# Altium schematic sheet Display.SchDoc
size 381 x 241 mm; SheetNumber: 1; SheetTotal: 1
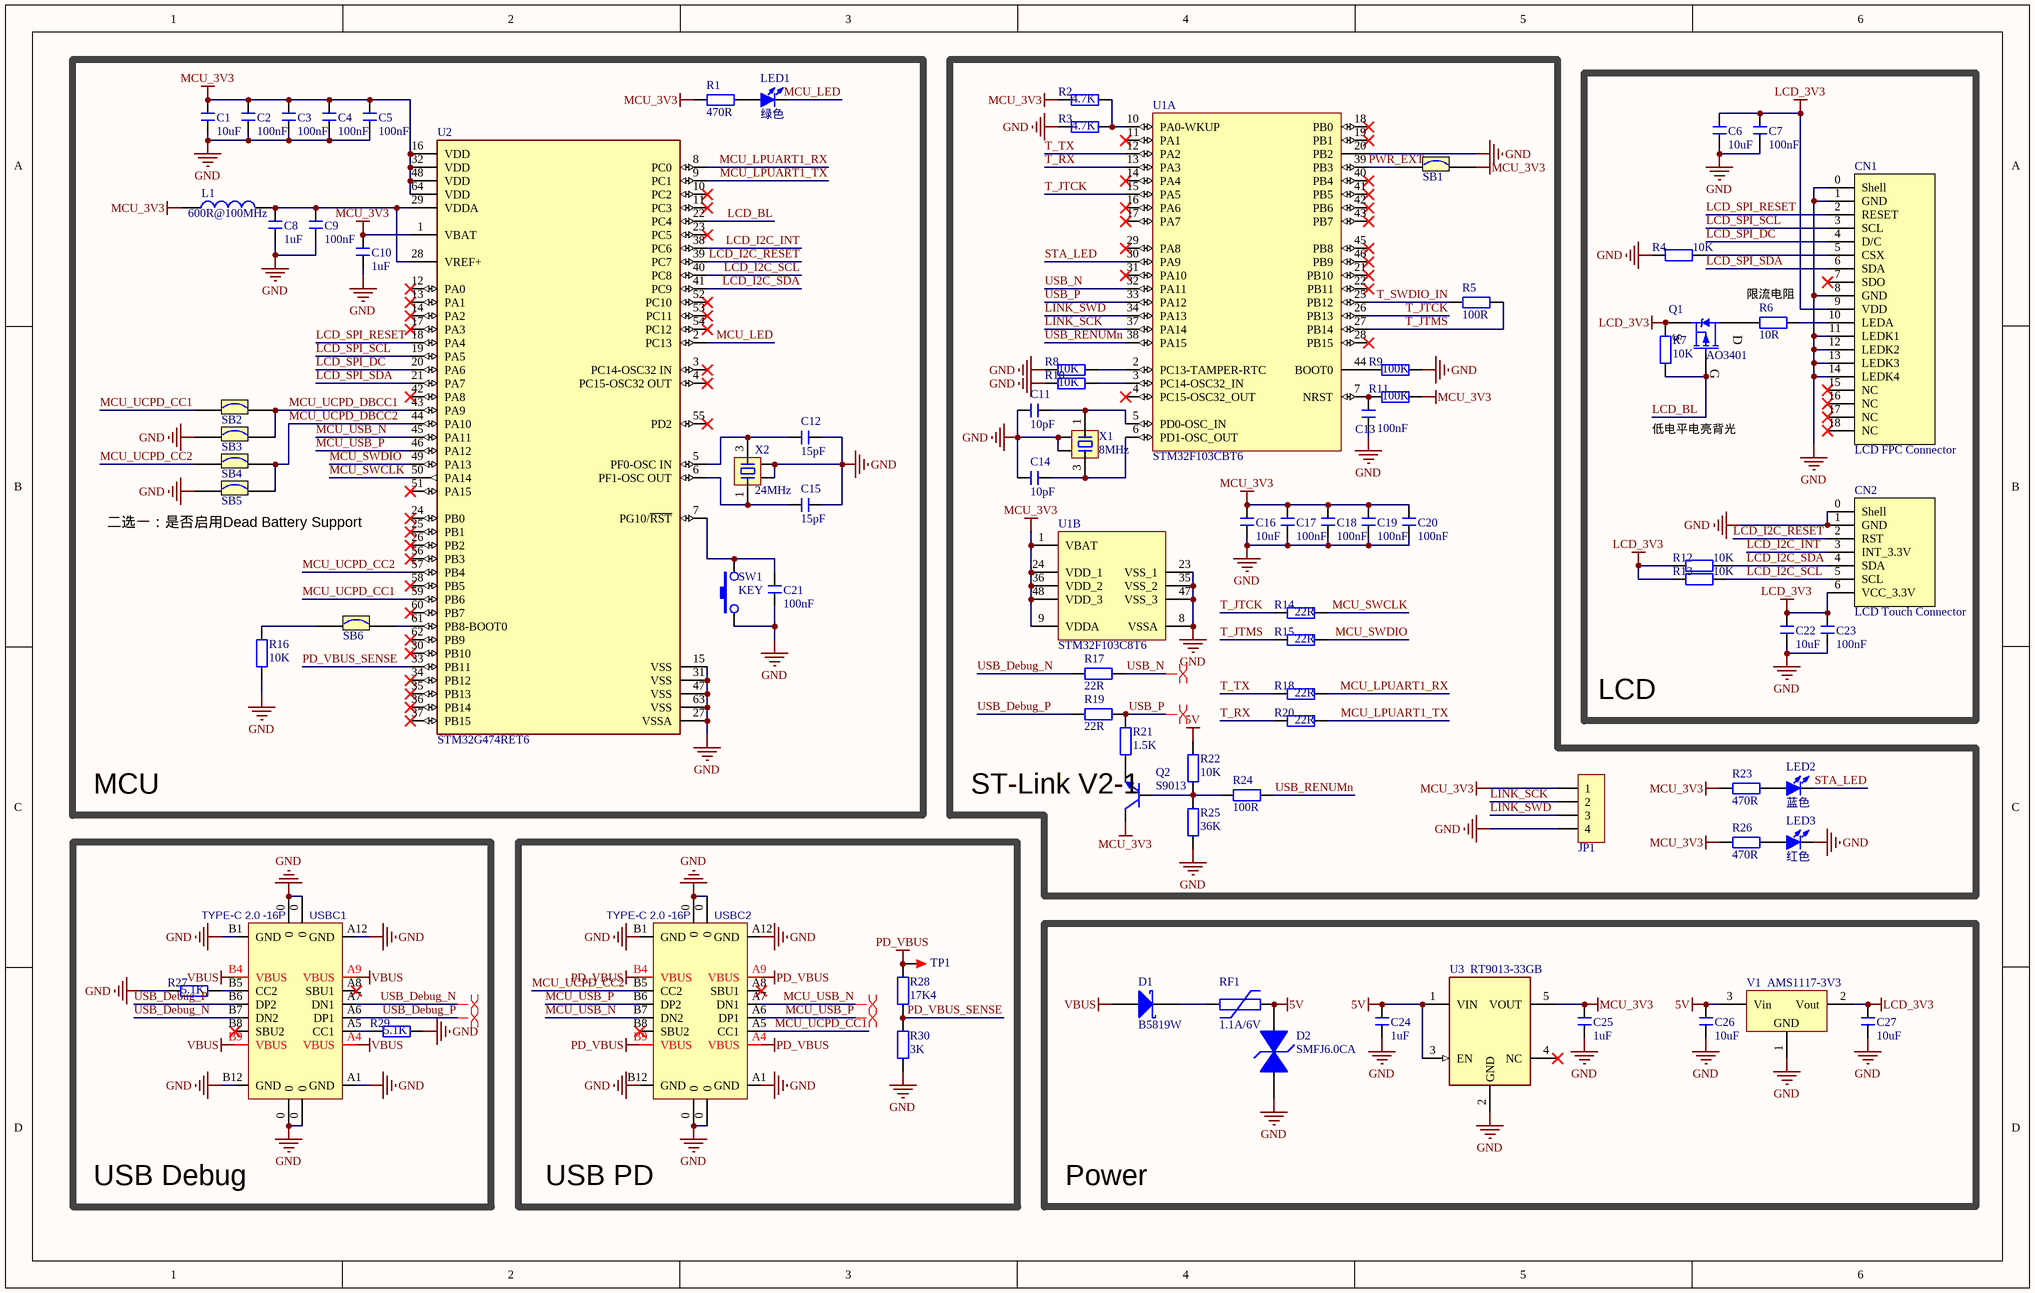
[diagram p0: Display.SchDoc]

## Parts
C1  10uF  [C 0402_L]
C2  100nF  [C 0402_L]
C3  100nF  [C 0402_L]
C4  100nF  [C 0402_L]
C5  100nF  [C 0402_L]
C6  10uF  [C 0402_L]
C7  100nF  [C 0402_L]
C8  1uF  [C 0402_L]
C9  100nF  [C 0402_L]
C10  1uF  [C 0402_L]
C11  10pF  [C 0402_L]
C12  15pF  [C 0402_L]
C13  100nF  [C 0402_L]
C14  10pF  [C 0402_L]
C15  15pF  [C 0402_L]
C16  10uF  [C 0402_L]
C17  100nF  [C 0402_L]
C18  100nF  [C 0402_L]
C19  100nF  [C 0402_L]
C20  100nF  [C 0402_L]
C21  100nF  [C 0402_L]
C22  10uF  [C 0402_L]
C23  100nF  [C 0402_L]
C24  1uF  [C 0402_L]
C25  1uF  [C 0402_L]
C26  10uF  [C 0402_L]
C27  10uF  [C 0402_L]
CN1  LCD FPC Connector  [FPC_Connector_0.5mm_18P]
CN2  LCD Touch Connector  [FPC_Connector_0.5mm_6P]
D1  B5819W  [MCC-SOD123_V]
D2  SMFJ6.0CA  [SMFJ6.0CA]
JP1  HDR-1X4  [HDR2.54-LI-4P]  (value not drawn)
L1  600R@100MHz  [L 0603]
LED1  绿色  [LED 0603G]
LED2  蓝色  [LED 0603B]
LED3  红色  [LED 0603R]
Q1  AO3401  [SOT23-3L]
Q2  S9013  [SOT23-3L]
R1  470R  [R 0402_L]
R2  4.7K  [R 0402_L]
R3  4.7K  [R 0402_L]
R4  10K  [R 0402_L]
R5  100R  [R 0402_L]
R6  10R  [R 0402_L]
R7  10K  [R 0402_L]
R8  10K  [R 0402_L]
R9  100K  [R 0402_L]
R10  10K  [R 0402_L]
R11  100K  [R 0402_L]
R12  10K  [R 0402_L]
R13  10K  [R 0402_L]
R14  22R  [R 0402_L]
R15  22R  [R 0402_L]
R16  10K  [R 0402_L]
R17  22R  [R 0402_L]
R18  22R  [R 0402_L]
R19  22R  [R 0402_L]
R20  22R  [R 0402_L]
R21  1.5K  [R 0402_L]
R22  10K  [R 0402_L]
R23  470R  [R 0402_L]
R24  100R  [R 0402_L]
R25  36K  [R 0402_L]
R26  470R  [R 0402_L]
R27  5.1K  [R 0402_L]
R28  17K4  [R 0402_L]
R29  5.1K  [R 0402_L]
R30  3K  [R 0402_L]
RF1  1.1A/6V  [MF-NSMF110-2]
SB1  SelectBit  [SelectBit 0402]  (value not drawn)
SB2  SelectBit  [SelectBit 0402]  (value not drawn)
SB3  SelectBit  [SelectBit 0402]  (value not drawn)
SB4  SelectBit  [SelectBit 0402]  (value not drawn)
SB5  SelectBit  [SelectBit 0402]  (value not drawn)
SB6  SelectBit  [SelectBit 0402]  (value not drawn)
SW1  KEY  [小乌龟2脚轻触开关3.9*2.9]
TP1  TEST TP  [TEST TP1.4_R]  (value not drawn)
U1  STM32F103CBT6  [STM-LQFP48_L]  (parts A,B of 2)
U2  STM32G474RET6  [FP-LQFP64-5W-MFG]
U3  RT9013-33GB  [SOT94P279X129-5N]
USBC1  TYPE-C 2.0 -16P  [USB-C-SMD_16P]
USBC2  TYPE-C 2.0 -16P  [USB-C-SMD_16P]
V1  AMS1117-3V3  [SOT89_L]
X1  8MHz  [XTAL-3225-4P]
X2  24MHz  [XTAL-3225-4P]

## Blocks framed on the sheet
MCU: C1-C5 C8-C10 C12 C15 C21 L1 LED1 R1 R16 SB2-SB6 SW1 U2 X2
ST-Link V2-1: C11 C13 C14 C16-C20 JP1 LED2 LED3 Q2 R2 R3 R5 R8-R11 R14 R15 R17-R26 SB1 U1 X1
LCD: C6 C7 C22 C23 CN1 CN2 Q1 R4 R6 R7 R12 R13
USB Debug: R27 R29 USBC1
USB PD: R28 R30 TP1 USBC2
Power: C24-C27 D1 D2 RF1 U3 V1

## Nets
5V: C24.2 C26.2 D2.2 R22.2 RF1.2 U3.1(VIN) U3.3(EN) V1.3(Vin)
GND: C1.1 C2.1 C3.1 C4.1 C5.1 C6.1 C7.1 C8.1 C9.1 C10.1 C11.2 C12.1 C13.1 C14.2 C15.1 C16.1 C17.1 C18.1 C19.1 C20.1 C21.2 C22.1 C23.1 C24.1 C25.1 C26.1 C27.1 CN1.0(Shell) CN1.1(GND) CN1.8(GND) CN1.11(LEDK1) CN1.12(LEDK2) CN1.13(LEDK3) CN1.14(LEDK4) CN2.0(Shell) CN2.1(GND) D2.1 JP1.4 LED3.2(K) R3.1 R4.1 R8.2 R9.1 R10.2 R16.2 R25.1 R27.2 R29.1 R30.2 SB3.1 SB5.1 SW1.1 U1.8(VSSA) U1.20(PB2) U1.23(VSS_1) U1.35(VSS_2) U1.47(VSS_3) U2.15(VSS) U2.27(VSSA) U2.31(VSS) U2.47(VSS) U2.63(VSS) U3.2(GND) USBC1.0 USBC1.A1(GND) USBC1.A12(GND) USBC1.B1(GND) USBC1.B12(GND) USBC2.0 USBC2.A1(GND) USBC2.A12(GND) USBC2.B1(GND) USBC2.B12(GND) V1.1(GND) X1.2 X1.4 X2.2 X2.4
LCD_3V3: C6.2 C7.2 C22.2 C23.2 C27.2 CN1.9(VDD) CN2.6(VCC_3.3V) Q1.2(S) R7.2 R12.2 R13.2 V1.2(Vout)
MCU_3V3: C1.2 C2.2 C3.2 C4.2 C5.2 C10.2 C16.2 C17.2 C18.2 C19.2 C20.2 C25.2 JP1.1 L1.1 Q2.3(C) R1.2 R2.1 R11.1 R23.2 R26.2 SB1.2 U1.1(VBAT) U1.9(VDDA) U1.24(VDD_1) U1.36(VDD_2) U1.48(VDD_3) U2.1(VBAT) U2.16(VDD) U2.32(VDD) U2.48(VDD) U2.64(VDD) U3.5(VOUT)
PD_VBUS: R28.1 TP1.1 USBC2.A4(VBUS) USBC2.A9(VBUS) USBC2.B4(VBUS) USBC2.B9(VBUS)
VBUS: D1.1(A) USBC1.A4(VBUS) USBC1.A9(VBUS) USBC1.B4(VBUS) USBC1.B9(VBUS)
LCD_BL: Q1.1(G) R7.1 U2.22(PC4)
LCD_I2C_INT: CN2.3(INT_3.3V) U2.38(PC6)
LCD_I2C_RESET: CN2.2(RST) U2.39(PC7)
LCD_I2C_SCL: CN2.5(SCL) R13.1 U2.40(PC8)
LCD_I2C_SDA: CN2.4(SDA) R12.1 U2.41(PC9)
LCD_SPI_DC: CN1.4(D/C) U2.20(PA6)
LCD_SPI_RESET: CN1.2(RESET) U2.18(PA4)
LCD_SPI_SCL: CN1.3(SCL) U2.19(PA5)
LCD_SPI_SDA: CN1.6(SDA) U2.21(PA7)
LINK_SCK: JP1.2 U1.37(PA14)
LINK_SWD: JP1.3 U1.34(PA13)
MCU_LED: LED1.2(K) U2.2(PC13)
MCU_LPUART1_RX: R18.1 U2.8(PC0)
MCU_LPUART1_TX: R20.1 U2.9(PC1)
MCU_SWCLK: R14.1 U2.50(PA14)
MCU_SWDIO: R15.1 U2.49(PA13)
MCU_UCPD_CC1: SB2.1 U2.59(PB6) USBC2.A5(CC1)
MCU_UCPD_CC2: SB4.1 U2.57(PB4) USBC2.B5(CC2)
MCU_UCPD_DBCC1: SB2.2 SB3.2 U2.43(PA9)
MCU_UCPD_DBCC2: SB4.2 SB5.2 U2.44(PA10)
MCU_USB_N: U2.45(PA11) USBC2.A7(DN1) USBC2.B7(DN2)
MCU_USB_P: U2.46(PA12) USBC2.A6(DP1) USBC2.B6(DP2)
PD_VBUS_SENSE: R28.2 R30.1 U2.33(PB11)
PWR_EXT: SB1.1 U1.39(PB3)
STA_LED: LED2.2(K) U1.30(PA9)
T_JTCK: R14.2 U1.15(PA5) U1.26(PB13)
T_JTMS: R5.1 R15.2 U1.27(PB14)
T_RX: R20.2 U1.13(PA3)
T_SWDIO_IN: R5.2 U1.25(PB12)
T_TX: R18.2 U1.12(PA2)
USB_Debug_N: R17.1 USBC1.A7(DN1) USBC1.B7(DN2)
USB_Debug_P: R19.1 USBC1.A6(DP1) USBC1.B6(DP2)
USB_N: R17.2 U1.32(PA11)
USB_P: R19.2 R21.2 U1.33(PA12)
USB_RENUMn: R24.1 U1.38(PA15)
NetC8_2: C8.2 C9.2 L1.2 U2.28(VREF+) U2.29(VDDA)
NetC11_1: C11.1 U1.5(PD0-OSC_IN) X1.1
NetC12_2: C12.2 U2.5(PF0-OSC_IN) X2.3
NetC13_2: C13.2 R11.2 U1.7(NRST)
NetC14_1: C14.1 U1.6(PD1-OSC_OUT) X1.3
NetC15_2: C15.2 U2.6(PF1-OSC_OUT) X2.1
NetC21_1: C21.1 SW1.3 U2.7(PG10/~{RST})
NetCN1_5: CN1.5(CSX) R4.2
NetCN1_10: CN1.10(LEDA) R6.2
NetD1_2: D1.2(K) RF1.1
NetLED1_1: LED1.1(A) R1.1
NetLED2_1: LED2.1(A) R23.1
NetLED3_1: LED3.1(A) R26.1
NetQ1_3: Q1.3(D) R6.1
NetQ2_1: Q2.1(B) R22.1 R24.2 R25.2
NetQ2_2: Q2.2(E) R21.1
NetR2_2: R2.2 R3.2 U1.10(PA0-WKUP)
NetR8_1: R8.1 U1.2(PC13-TAMPER-RTC)
NetR9_2: R9.2 U1.44(BOOT0)
NetR10_1: R10.1 U1.3(PC14-OSC32_IN)
NetR16_1: R16.1 SB6.1
NetR27_1: R27.1 USBC1.B5(CC2)
NetR29_2: R29.2 USBC1.A5(CC1)
NetSB6_2: SB6.2 U2.61(PB8-BOOT0)

Not connected (* = marked no-connect by the designer): CN1 7(SDO)* 15(NC)* 16(NC)* 17(NC)* 18(NC)*; U1 4(PC15-OSC32_OUT)* 11(PA1)* 14(PA4)* 16(PA6)* 17(PA7)* 18(PB0)* 19(PB1)* 21(PB10)* 22(PB11)* 28(PB15)* 29(PA8)* 31(PA10)* 40(PB4)* 41(PB5)* 42(PB6)* 43(PB7)* 45(PB8)* 46(PB9)*; U2 3(PC14-OSC32_IN)* 4(PC15-OSC32_OUT)* 10(PC2)* 11(PC3)* 12(PA0)* 13(PA1)* 14(PA2)* 17(PA3)* 23(PC5)* 24(PB0)* 25(PB1)* 26(PB2)* 30(PB10)* 34(PB12)* 35(PB13)* 36(PB14)* 37(PB15)* 42(PA8)* 51(PA15)* 52(PC10)* 53(PC11)* 54(PC12)* 55(PD2)* 56(PB3)* 58(PB5)* 60(PB7)* 62(PB9)*; U3 4(NC)*; USBC1 A8(SBU1)* B8(SBU2)*; USBC2 A8(SBU1)* B8(SBU2)*

## Layout directives
differential pair: MCU_USB_N, MCU_USB_P, USB_Debug_N, USB_Debug_P, USB_N, USB_P

## Notes on the sheet
- 限流电阻
- 低电平电亮背光
- (near SB5) 二选一：是否启用Dead Battery Support

## Library data of the parts
C1-C27 = C: 无极性贴片电容; 版权归属: 源创客; BOM名称: 无极性贴片电容; 学习资源: www.ooocke.com
CN1 = LCD: 2.8英寸TFT-LCD电容触摸屏接插式FPC座子
CN2 = Touch: 2.8英寸TFT-LCD电容触摸屏触摸检测芯片接插式FPC座子
D1 = CMP-2100-03587-1: Schottky Barrier Rectifier, 1 A, 40 Vrm, -65 to 125 degC, 2-Pin SOD123, RoHS, Tape and Reel; Manufacturer: Micro Commercial Components; Package Description: 2-Pin Small Outline Diode, Body 2.7 x 1.6 mm, Height 1.35 mm; Datasheet URL: http://www.mccsemi.com/up_pdf/B5817W-B5819W(SOD-123).pdf; Manufacturer URL: http://www.mccsemi.com/; Package Reference: SOD123; Package URL: http://www.mccsemi.com/up_pdf/1N4448W(SOD-123).pdf; Datasheet Version: Rev. B, 01/2013
D2 = SMFJ6.0CA: 贴片TVS瞬变抑制二极管
JP1 = Header 4: 4P接插件; 封装库来自淘宝卖家 ID：黄晶宝石: 其他店铺购入均为盗版假冒封装库; 联系卖家，免费查找封装: 唯一出售店铺网址https://shop463601444.taobao.com; BOM名称: 4P接插件
L1 = L: 小功率贴片电感; 版权归属: 源创客; BOM名称: 小功率贴片电感; 学习资源: www.ooocke.com
LED1-LED3 = LED-SMD: 贴片LED; 版权归属: 源创客; BOM名称: 贴片LED; 学习资源: www.ooocke.com
Q1 = AO3401: P沟道 30V/4.2A; BOM名称: 场效应管; 联系卖家，免费查找封装: 唯一出售店铺网址https://shop463601444.taobao.com; 参数: P沟道 30V/4.2A
Q2 = 9013-SMD: 低频放大-NPN型; 版权归属: 源创客; 属性: 50V?0.5A?0.625W; BOM名称: 低频放大-NPN型; 学习资源: www.ooocke.com
R1-R30 = R: 贴片电阻; 版权归属: 源创客; BOM名称: 贴片电阻; 学习资源: www.ooocke.com
RF1 = PPTC: PPTC自恢复保险丝; 版权归属: 源创客; BOM名称: PPTC自恢复保险丝; 学习资源: www.ooocke.com
SB1-SB6 = SelectBit: 跨接桥，用于选择不同的模式，可以用锡连上，或者焊上0R电阻
SW1 = KEY: 轻触开关
TP1 = TEST TP: 测试环; 版权归属: 源创客; BOM名称: 测试环; 学习资源: www.ooocke.com
U1 = CMP-0237-00215-3: ARM Cortex-M3 32-bit MCU, 64 KB Flash, 20 KB Internal RAM, 37 I/Os, 48-pin LQFP, -40 to 85 degC, Tray; PartNumber: STM32F103C8T6; Supply Voltage(Vcc) min (V): 2; Internal RAM Size (kB): 20; FLASH Size (Prog) (kB): 64; A/D Converter: 2x12-bit (10 Channel); I/Os (High Current): 37; Operating Frequency(F) (Processor speed) (MHz): 72; Core: ARM Cortex-M3; ComponentLink3Description: Package Specification; Mounting Technology: Surface Mount; PackageReference: LQFP48; Packing: Tray; ComponentLink3URL: http://www.st.com/st-web-ui/static/active/en/resource/technical/document/datasheet/DM00058181.pdf; DatasheetVersion: Rev. 16; ComponentLink1URL: http://www.st.com/web/en/home.html; PackageVersion: Rev. 6, 06/2013; ComponentLink2URL: http://www.st.com/st-web-ui/static/active/en/resource/technical/document/datasheet/CD00161566.pdf; ComponentLink1Description: Manufacturer URL; ComponentLink2Description: Datasheet; PackageDescription: 48-Pin Low Profile Quad Flat Package, 7 x 7 mm Body, 0.5 mm Pitch
U2 = CMP-12105-000051-1: MAINSTREAM ARM CORTEX-M4 CORE WI; Manufacturer: STMicroelectronics; Ram Size: 128KBytes; Interface: I2C,SPI,UART,USART,CAN,USB,LIN,IrDA,I2S,SMBus,Other; Number Of I2C Channels: 4; Number Of A/D Converters: 5; Number Of Timers/Counters: 14; Number Of I/Os: 52; Max Supply Voltage: 3.6V; Memory Size: 512KBytes; Number Of Adc Channels: 26; Number Of Cores: 1; Min Supply Voltage: 1.71V; Max Junction Temp: +105°C; Standoff Height: 0.05mm; Number Of Uart Channels: 6; Number Of Spi Channels: 3; Frequency: 170MHz; Data Bus Width: 32bits; Memory Type: FLASH; Number Of Pwm Channels: 32; Package: LQFP64-5W; Manufacturer Part Number: STM32G474RET6; Height: 1.6mm; Mouser Description: Microcontroller 32-Bit ARM Cortex-M4 RISC 512KB Flash 1.71V to 3.6V 64-Pin LQFP; Temperature Range High: +105°C; Octopart: https://octopart.com/stm32g474ret6-stmicroelectronics-102308483; Category: IC; Automotive: No; ComponentLink2URL: https://www.st.com/resource/en/datasheet/stm32g474cb.pdf; Temperature Range Low: -40°C; Device Class L1: Integrated Circuits (ICs); Device Class L2: Embedded Processors and Controllers; Core Architecture: ARM Cortex-M4; Ambient Temperature Range Low: -40°C; ComponentLink2Description: Datasheet; Temperature: -40°C to +105°C; Digikey Description: MAINSTREAM ARM CORTEX-M4 CORE WI; Lead Free: Yes; RoHS: TRUE; Ambient Temperature Range High: +85°C; Device Class L3: Microcontrollers; Number Of Usb Channels: 1
U3 = RT9013-33GB: Linear Voltage Regulator IC 1 Output 500mA SOT-23-5; MF: Richtek USA; Availability: Unavailable; Price: None; SnapEDA_Link: https://www.snapeda.com/parts/RT9013-33GB/Richtek%20USA%20Inc./view-part/553199/?ref=snap; Value: *; MP: RT9013-33GB; Package: SOT-23-5 Richtek
USBC1 USBC2 = USB2.0_Type-C_16Pin: USB2.0_Type-C_16Pin母座; 联系卖家 免费查找封装: 唯一出售店铺网址https://shop463601444.taobao.com; 联系卖家 免费技术支持: 封装库来自淘宝卖家ID：黄晶宝石
V1 = AMS1117: 三端稳压芯片; BOM名称: 稳压芯片; 版权归属: 源创客; 学习资源: www.ooocke.com
X1 X2 = XTAL-4P: 4脚无源晶振(谐振器）; 联系卖家，免费查找封装: 唯一出售店铺网址https://shop463601444.taobao.com; BOM名称: 4脚无源晶振(谐振器）